# EAGLE design dev_kit_f103v5 (EAGLE 9.6.2)
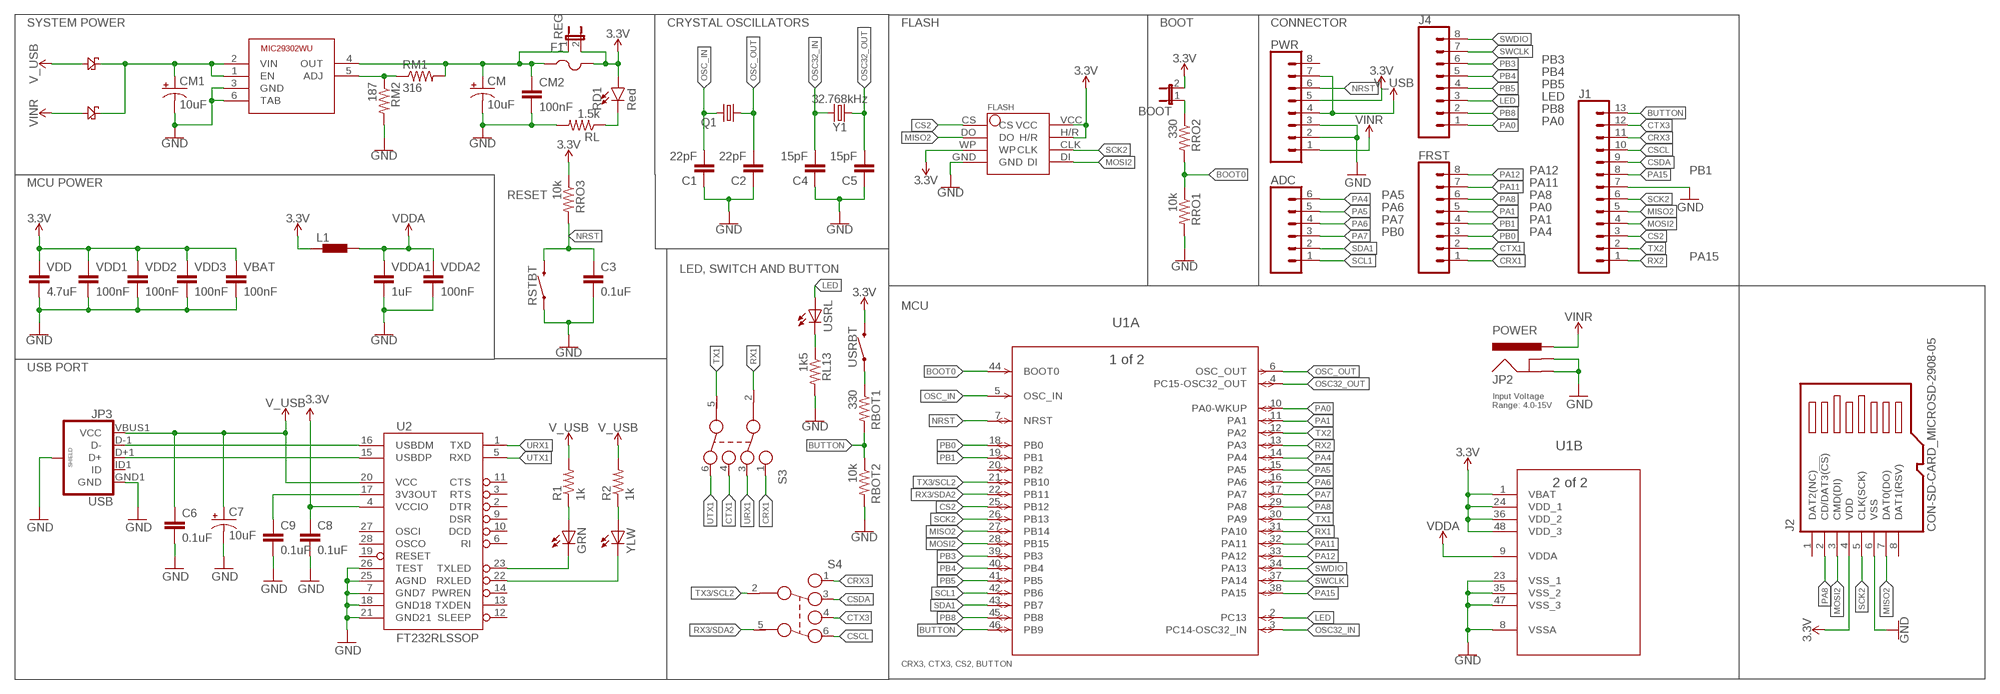
[diagram p0: schematic, sheet 1]

## Parts
ADC  CONN_06SILK_FEMALE_PTH  [1X06]
BOOT  JP1E  [JP1]
C1  22pF  22PF-0603-50V-5%  [0603]
C2  22pF  22PF-0603-50V-5%  [0603]
C3  0.1uF  22PF-0603-50V-5%  [0603]
C4  15pF  22PF-0603-50V-5%  [0603]
C5  15pF  22PF-0603-50V-5%  [0603]
C6  0.1uF  CAP0402-CAP  [0402-CAP]
C7  10uF  CAP_POL1206  [EIA3216]
C8  0.1uF  CAP0402-CAP  [0402-CAP]
C9  0.1uF  CAP0402-CAP  [0402-CAP]
CM  10uF  10UF-POLAR-EIA3528-20V-10%(TANT)  [EIA3528]
CM1  10uF  10UF-POLAR-EIA3528-20V-10%(TANT)  [EIA3528]
CM2  100nF  0.1UF-0603-25V-(+80/-20%)  [0603]
D1  3ASCHOOTKY  [3ASCHOOTKY]
D2  3ASCHOOTKY  [3ASCHOOTKY]
F1  PTCFUSE-1812  [1812]
FLASH  W25Q64  [W25Q64]
FRST  CONN_08"  [1X08]
GRN  LEDCHIP-LED0603  [CHIP-LED0603]
IC1  MIC29302WU  [TO263-5]
J1  CONN_13  [1X13]
J2  CON-SD-CARD_MICROSD-2908-05  [CON-SD-CARD_2908-05]
J4  CONN_08"  [1X08]
JP2  POWER  POWER_JACKPTH_LOCK  [POWER_JACK_PTH_LOCK]
JP3  USB  USB_MICROB_PLUGCONN-11752  [USB-B-MICRO-SMD_V03]
L1  BLM15HB221SN1  [0402]
PWR  CONN_08"  [1X08]
Q1  CRYSTALHC49S  [HC49/S]
R1  1k  RESISTOR0402-RES  [0402-RES]
R2  1k  RESISTOR0402-RES  [0402-RES]
RBOT1  330  2.0KOHM1/10W5%(0603)  [0603-RES]
RBOT2  10k  2.0KOHM1/10W5%(0603)  [0603-RES]
RD1  Red  LED-RED0603-SMART  [LED-0603]
REG  JP1E  [JP1]
RL  1.5k  2.0KOHM1/10W5%(0603)  [0603-RES]
RL13  1k5  2.0KOHM1/10W5%(0603)  [0603-RES]
RM1  316  2.0KOHM1/10W5%(0603)  [0603-RES]
RM2  187  2.0KOHM1/10W5%(0603)  [0603-RES]
RRO1  10k  2.0KOHM1/10W5%(0603)  [0603-RES]
RRO2  330  2.0KOHM1/10W5%(0603)  [0603-RES]
RRO3  10k  2.0KOHM1/10W5%(0603)  [0603-RES]
RSTBT  MOMENTARY-SWITCH-SPST-SMD-6.0X3.5MM  [TACTILE_SWITCH_SMD_6.0X3.5MM]
S3  452403012014  [452403012014]
S4  452403012014  [452403012014]
U1  STM32F103C8T6  [LQFP48-7X7MM]
U2  FT232RLSSOP  [SSOP28DB]
USRBT  MOMENTARY-SWITCH-SPST-SMD-6.0X3.5MM  [TACTILE_SWITCH_SMD_6.0X3.5MM]
USRL  LEDCHIP-LED0603  [CHIP-LED0603]
VBAT  100nF  0.1UF-0603-25V-(+80/-20%)  [0603]
VDD  4.7uF  0.1UF-0603-25V-(+80/-20%)  [0603]
VDD1  100nF  0.1UF-0603-25V-(+80/-20%)  [0603]
VDD2  100nF  0.1UF-0603-25V-(+80/-20%)  [0603]
VDD3  100nF  0.1UF-0603-25V-(+80/-20%)  [0603]
VDDA1  1uF  0.1UF-0603-25V-(+80/-20%)  [0603]
VDDA2  100nF  0.1UF-0603-25V-(+80/-20%)  [0603]
Y1  32.768kHz  CRYSTAL-32.768KHZPTH-2X6-KIT  [CRYSTAL-PTH-2X6-CYL-KIT]
YLW  LEDCHIP-LED0603  [CHIP-LED0603]

## Nets
3.3V: BOOT.2 F1.2 FLASH.H/R FLASH.VCC FLASH.WP J2.4(VDD) L1.1 PWR.5 RD1.A REG.2 RRO3.1 U1.1(B:VBAT) U1.24(B:VDD_1) U1.36(B:VDD_2) U1.48(B:VDD_3) USRBT.2 VBAT.1 VDD1.1 VDD2.1 VDD3.1 VDD.1
BOOT0: RRO1.1 RRO2.2 U1.44(A:BOOT0)
BUTTON: J1.13 RBOT1.2 RBOT2.1 U1.46(A:PB9)
CRX1: FRST.1 S3.1
CRX3: J1.11 S4.1
CS2: FLASH.CS J1.3 U1.25(A:PB12)
CSCL: J1.10 S4.6
CSDA: J1.9 S4.3
CTX1: FRST.2 S3.4
CTX3: J1.12 S4.4
GND: C1.1 C2.1 C3.2 C4.1 C5.1 C6.2 C7.C(-) C8.2 C9.2 CM1.C(-) CM2.2 CM.C(-) FLASH.GND IC1.3(GND) IC1.6(TAB) J1.7 J2.6(VSS) JP2.GND JP2.GNDBREAK JP3.GND1(GND) JP3.SHIELD1(SHIELD) JP3.SHIELD2(SHIELD) JP3.SHIELD3(SHIELD) PWR.2 PWR.3 RBOT2.2 RL13.2 RL.2 RM2.2 RRO1.2 RSTBT.1 U1.8(B:VSSA) U1.23(B:VSS_1) U1.35(B:VSS_2) U1.47(B:VSS_3) U2.7(GND7) U2.18(GND18) U2.21(GND21) U2.25(AGND) U2.26(TEST) VBAT.2 VDD1.2 VDD2.2 VDD3.2 VDD.2 VDDA1.2 VDDA2.2
LED: J4.3 U1.2(A:PC13) USRL.A
MISO2: FLASH.DO J1.5 J2.7(DAT0(DO)) U1.27(A:PB14)
MOSI2: FLASH.DI J1.4 J2.3(CMD(DI)) U1.28(A:PB15)
N$1: CM1.A(+) D1.OUT D2.OUT IC1.1(EN) IC1.2(VIN)
N$2: CM2.1 CM.A(+) F1.1 IC1.4(OUT) REG.1 RM1.2
N$3: BOOT.1 RRO2.1
N$4: RL13.1 USRL.C
N$5: RBOT1.1 USRBT.1
N$6: GRN.A R1.1
N$7: R2.1 YLW.A
N$8: C9.1 U2.17(3V3OUT)
N$20: IC1.5(ADJ) RM1.1 RM2.1
N$35: RD1.C RL.1
NRST: C3.1 PWR.6 RRO3.2 RSTBT.2 U1.7(A:NRST)
OSC32_IN: C4.2 U1.3(A:PC14-OSC32_IN) Y1.2
OSC32_OUT: C5.2 U1.4(A:PC15-OSC32_OUT) Y1.1
OSC_IN: C1.2 Q1.2 U1.5(A:OSC_IN)
OSC_OUT: C2.2 Q1.1 U1.6(A:OSC_OUT)
PA0: J4.1 U1.10(A:PA0-WKUP)
PA1: FRST.5 U1.11(A:PA1)
PA4: ADC.6 U1.14(A:PA4)
PA5: ADC.5 U1.15(A:PA5)
PA6: ADC.4 U1.16(A:PA6)
PA7: ADC.3 U1.17(A:PA7)
PA8: FRST.6 J2.2(CD/DAT3(!CS!)) U1.29(A:PA8)
PA11: FRST.7 U1.32(A:PA11)
PA12: FRST.8 U1.33(A:PA12)
PA15: J1.8 U1.38(A:PA15)
PB0: FRST.3 U1.18(A:PB0)
PB1: FRST.4 U1.19(A:PB1)
PB3: J4.6 U1.39(A:PB3)
PB4: J4.5 U1.40(A:PB4)
PB5: J4.4 U1.41(A:PB5)
PB8: J4.2 U1.45(A:PB8)
RX1: S3.2 U1.31(A:PA10)
RX2: J1.1 U1.13(A:PA3)
RX3/SDA2: S4.5 U1.22(A:PB11)
RXLED: U2.22(RXLED) YLW.C
SCK2: FLASH.CLK J1.6 J2.5(CLK(SCK)) U1.26(A:PB13)
SCL1: ADC.1 U1.42(A:PB6)
SDA1: ADC.2 U1.43(A:PB7)
SWCLK: J4.7 U1.37(A:PA14)
SWDIO: J4.8 U1.34(A:PA13)
TX1: S3.5 U1.30(A:PA9)
TX2: J1.2 U1.12(A:PA2)
TX3/SCL2: S4.2 U1.21(A:PB10)
TXLED: GRN.C U2.23(TXLED)
URX1: S3.3 U2.1(TXD)
USB_D+: JP3.D+1(D+) U2.15(USBDP)
USB_D-: JP3.D-1(D-) U2.16(USBDM)
UTX1: S3.6 U2.5(RXD)
V_USB: C6.1 C7.A(+) D1.IN JP3.VBUS1(VCC) PWR.4 PWR.7 R1.2 R2.2 U2.20(VCC)
VCC: C8.1 U2.4(VCCIO) ; supply symbol labelled 3.3V
VDDA: L1.2 U1.9(B:VDDA) VDDA1.1 VDDA2.1
VIN: D2.IN JP2.PWR PWR.1 ; supply symbol labelled VINR
Unconnected: J2.1(DAT2(NC)) J2.8(DAT1(RSV)) J2.GND@1(GND) J2.GND@2(GND) J2.GND@3(GND) J2.GND@4(GND) JP3.ID1(ID) PWR.8 U1.20(A:PB2) U2.2(DTR) U2.3(RTS) U2.6(RI) U2.9(DSR) U2.10(DCD) U2.11(CTS) U2.12(SLEEP) U2.13(TXDEN) U2.14(PWREN) U2.19(RESET) U2.27(OSCI) U2.28(OSCO)

## Notes on the sheet
- SYSTEM POWER | CRYSTAL OSCILLATORS | FLASH | BOOT | CONNECTOR
- PB3
- PB4
- PB5
- LED
- PB8
- PA0
- PA12 | PB1
- MCU POWER | PA11
- RESET | PA5 | PA8
- PA6 | PA0
- PA7 | PA1
- PB0 | PA4
- PA15
- LED, SWITCH AND BUTTON
- MCU
- USB PORT
- Input Voltage
  Range: 4.0-15V
- CRX3, CTX3, CS2, BUTTON

## Library data of the parts
ADC = SparkFun-Connectors:CONN_06: Multi connection point. Often used as Generic Header-pin footprint for 0.1 inch spaced/style header connections On any of the 0.1 inch spaced packages, you can populate with these: Break Away Headers - Straight <https://www.sparkfun.com/products/116> (PRT-00116) Break Away Male Headers - Right Angle <https://www.sparkfun.com/products/553> (PRT-00553) Female Headers <https://www.sparkfun.com/products/115> (PRT-00115) Break Away Headers - Machine Pin <https://www.sparkfun.com/products/117> (PRT-00117) Break Away Female Headers - Swiss Machine Pin <https://www.sparkfun.com/products/743> (PRT-00743) Arduino Stackable Header - 6 Pin <https://www.sparkfun.com/products/9280> (PRT-09280) For SCREWTERMINALS and SPRING TERMINALS visit here: Screw Terimnals on SparkFun.com <https://www.sparkfun.com/search/results?term=Screw+Terminals> (5mm/3.5mm/2.54mm spacing) This device is also useful as a general connection point to wire up your design to another part of your project. Our various solder wires solder well into these plated through hole pads. Hook-Up Wire - Assortment (Stranded, 22 AWG) <https://www.sparkfun.com/products/11375> (PRT-11375) Hook-Up Wire - Assortment (Solid Core, 22 AWG) <https://www.sparkfun.com/products/11367> (PRT-11367) View the entire wire category on our website here <https://www.sparkfun.com/categories/141>; PROD_ID: CONN-08437
BOOT REG = jumper:JP1E: JUMPER
C1 C2 = SparkFun-Capacitors:22PF: 22pF ceramic capacitors A capacitor is a passive two-terminal electrical component used to store electrical energy temporarily in an electric field.; PROD_ID: CAP-07876
C3-C5 = SparkFun-Capacitors:22PF: 22pF ceramic capacitors A capacitor is a passive two-terminal electrical component used to store electrical energy temporarily in an electric field.; PROD_ID: CAP-07876; VALUE: 22pF
C6 C8 C9 = SparkFun:CAP: Capacitor Standard 0603 ceramic capacitor, and 0.1" leaded capacitor.
C7 = SparkFun:CAP_POL: Capacitor Polarized These are standard SMD and PTH capacitors. Normally 10uF, 47uF, and 100uF in electrolytic and tantalum varieties. Always verify the external diameter of the through hole cap, it varies with capacity, voltage, and manufacturer. The EIA devices should be standard.
CM CM1 = SparkFun-Capacitors:10UF-POLAR: 10.0µF polarized capacitors A capacitor is a passive two-terminal electrical component used to store electrical energy temporarily in an electric field.; PROD_ID: CAP-08063
CM2 VBAT VDD VDD1-VDD3 VDDA1 VDDA2 = SparkFun-Capacitors:0.1UF: 0.1µF ceramic capacitors A capacitor is a passive two-terminal electrical component used to store electrical energy temporarily in an electric field.; PROD_ID: CAP-00810; VALUE: 0.1uF
D1 D2 = 1N4007:3ASCHOOTKY
F1 = adafruit:PTCFUSE: PTC fuses, resettable thermistors
FLASH = W25Q64:W25Q64
FRST J4 PWR = SparkFun-Connectors:CONN_08: Multi connection point. Often used as Generic Header-pin footprint for 0.1 inch spaced/style header connections On any of the 0.1 inch spaced packages, you can populate with these: Break Away Headers - Straight <https://www.sparkfun.com/products/116> (PRT-00116) Break Away Male Headers - Right Angle <https://www.sparkfun.com/products/553> (PRT-00553) Female Headers <https://www.sparkfun.com/products/115> (PRT-00115) Break Away Headers - Machine Pin <https://www.sparkfun.com/products/117> (PRT-00117) Break Away Female Headers - Swiss Machine Pin <https://www.sparkfun.com/products/743> (PRT-00743) Arduino Stackable Header - 8 Pin <https://www.sparkfun.com/products/9279> (PRT-09279) For SCREWTERMINALS and SPRING TERMINALS visit here: Screw Terimnals on SparkFun.com <https://www.sparkfun.com/search/results?term=Screw+Terminals> (5mm/3.5mm/2.54mm spacing) This device is also useful as a general connection point to wire up your design to another part of your project. Our various solder wires solder well into these plated through hole pads. Hook-Up Wire - Assortment (Stranded, 22 AWG) <https://www.sparkfun.com/products/11375> (PRT-11375) Hook-Up Wire - Assortment (Solid Core, 22 AWG) <https://www.sparkfun.com/products/11367> (PRT-11367) View the entire wire category on our website here <https://www.sparkfun.com/categories/141> Special notes: Molex polarized connector foot print use with SKU : PRT-08231 with associated crimp pins and housings. 1MM SMD Version SKU: PRT-10208 NOTES ON THE VARIANTS LOCK and LOCK_LONGPADS... This footprint was designed to help hold the alignment of a through-hole component (i.e. 6-pin header) while soldering it into place. You may notice that each hole has been shifted either up or down by 0.005 of an inch from it's more standard position (which is a perfectly straight line). This slight alteration caused the pins (the squares in the middle) to touch the edges of the holes. Because they are alternating, it causes a "brace" to hold the component in place. 0.005 has proven to be the perfect amount of "off-center" position when using our standard breakaway headers. Although looks a little odd when you look at the bare footprint, once you have a header in there, the alteration is very hard to notice. Also,if you push a header all the way into place, it is covered up entirely on the bottom side.; PROD_ID: CONN-08438
GRN USRL YLW = adafruit:LED: LED OSRAM: - CHIPLED LG R971, LG N971, LY N971, LG Q971, LY Q971, LO R971, LY R971 LH N974, LH R974 LS Q976, LO Q976, LY Q976 LO Q996 - Hyper CHIPLED LW Q18S LB Q993, LB Q99A, LB R99A - SideLED LS A670, LO A670, LY A670, LG A670, LP A670 LB A673, LV A673, LT A673, LW A673 LH A674 LY A675 LS A676, LA A676, LO A676, LY A676, LW A676 LS A679, LY A679, LG A679 - Hyper Micro SIDELED® LS Y876, LA Y876, LO Y876, LY Y876 LT Y87S - SmartLED LW L88C, LW L88S LB L89C, LB L89S, LG L890 LS L89K, LO L89K, LY L89K LS L896, LA L896, LO L896, LY L896 - TOPLED LS T670, LO T670, LY T670, LG T670, LP T670 LSG T670, LSP T670, LSY T670, LOP T670, LYG T670 LG T671, LOG T671, LSG T671 LB T673, LV T673, LT T673, LW T673 LH T674 LS T676, LA T676, LO T676, LY T676, LB T676, LH T676, LSB T676, LW T676 LB T67C, LV T67C, LT T67C, LS T67K, LO T67K, LY T67K, LW E67C LS E67B, LA E67B, LO E67B, LY E67B, LB E67C, LV E67C, LT E67C LW T67C LS T679, LY T679, LG T679 LS T770, LO T770, LY T770, LG T770, LP T770 LB T773, LV T773, LT T773, LW T773 LH T774 LS E675, LA E675, LY E675, LS T675 LS T776, LA T776, LO T776, LY T776, LB T776 LHGB T686 LT T68C, LB T68C - Hyper Mini TOPLED® LB M676 - Mini TOPLED Santana® LG M470 LS M47K, LO M47K, LY M47K Source: http://www.osram.convergy.de/
IC1 = MIC29302WU:MIC29302WU: Check prices <https://pricing.snapeda.com/parts/MIC29302WU/Microchip%20Technology/view-part?ref=eda>; AVAILABILITY: Good; DESCRIPTION: Linear Voltage Regulator IC Positive Adjustable 1 Output 3A TO-263-5; MF: Microchip Technology; MP: MIC29302WU; PACKAGE: TO-263-6 Microchip Technology; PRICE: None; PURCHASE-URL: https://pricing.snapeda.com/search/part/MIC29302WU/?ref=eda
J1 = SparkFun-Connectors:CONN_13: Multi connection point. Often used as Generic Header-pin footprint for 0.1 inch spaced/style header connections On any of the 0.1 inch spaced packages, you can populate with these: Break Away Headers - Straight <https://www.sparkfun.com/products/116> (PRT-00116) Break Away Male Headers - Right Angle <https://www.sparkfun.com/products/553> (PRT-00553) Female Headers <https://www.sparkfun.com/products/115> (PRT-00115) Break Away Headers - Machine Pin <https://www.sparkfun.com/products/117> (PRT-00117) Break Away Female Headers - Swiss Machine Pin <https://www.sparkfun.com/products/743> (PRT-00743) For SCREWTERMINALS and SPRING TERMINALS visit here: Screw Terimnals on SparkFun.com <https://www.sparkfun.com/search/results?term=Screw+Terminals> (5mm/3.5mm/2.54mm spacing) This device is also useful as a general connection point to wire up your design to another part of your project. Our various solder wires solder well into these plated through hole pads. Hook-Up Wire - Assortment (Stranded, 22 AWG) <https://www.sparkfun.com/products/11375> (PRT-11375) Hook-Up Wire - Assortment (Solid Core, 22 AWG) <https://www.sparkfun.com/products/11367> (PRT-11367) View the entire wire category on our website here <https://www.sparkfun.com/categories/141> Special notes: Molex polarized connector foot print use with SKU : PRT-08231 with associated crimp pins and housings. 1MM SMD Version SKU: PRT-10208 NOTES ON THE VARIANTS LOCK and LOCK_LONGPADS... This footprint was designed to help hold the alignment of a through-hole component (i.e. 6-pin header) while soldering it into place. You may notice that each hole has been shifted either up or down by 0.005 of an inch from it's more standard position (which is a perfectly straight line). This slight alteration caused the pins (the squares in the middle) to touch the edges of the holes. Because they are alternating, it causes a "brace" to hold the component in place. 0.005 has proven to be the perfect amount of "off-center" position when using our standard breakaway headers. Although looks a little odd when you look at the bare footprint, once you have a header in there, the alteration is very hard to notice. Also,if you push a header all the way into place, it is covered up entirely on the bottom side.
J2 = 52101-101-REV-A_v16:CON-SD-CARD_MICROSD-: microSD Connector
JP2 = SparkFun-Connectors:POWER_JACK: Power Jack This is the standard 5.5mm barrel jack for power. The PTH is the most common, proven, reliable, footprint. The Slot footprint only works if the mill layer is transmitted to the PCB fab house so be warned. Mating wall wart : TOL-00298 (and others); PROD_ID: CONN-08197; SF_ID: PRT-00119
JP3 = SparkFun-Connectors:USB_MICROB_PLUG: USB Micro-B connectors Some male, some female. Watch your step!; PROD_ID: CONN-11752
L1 = inductors:BLM15H: EMIFIL (R) Chip Ferrite Bead for GHz Noise Source: http://www.murata.com/ Ferrite Bead BLM15H.pdf
Q1 = crystal:CRYSTAL: CRYSTAL; OC_FARNELL: 1667008; OC_NEWARK: unknown
R1 R2 = SparkFun:RESISTOR: Resistor Basic schematic elements and footprints for 0603, 1206, and PTH resistors.
RBOT1 RBOT2 RL RL13 RM1 RM2 RRO1-RRO3 = SparkFun-Resistors:2.0KOHM1/10W5%(0603): RES-08296; PROD_ID: RES-08296; VALUE: 2.0k
RD1 = SparkFun-LED:LED-RED: Red SMD LED Used in manufacturing of most products at SparkFun Packages: 0603 - SMD 0603 package [Product Link] <http://docs.avagotech.com/docs/AV02-0551EN> 0603 SMART - SMD 0603 SMART package ( more efficient and expensive)[Product Link] <http://www.osram-os.com/Graphics/XPic2/00077099_0.pdf> 1206 - SMD1206 package [Product Link] <https://www.sparkfun.com/datasheets/DevTools/LilyPad/Q150OVS4.pdff> SparkFun Products: Pro Mini 328 -5V <https://www.sparkfun.com/products/821> RedBoard <https://www.sparkfun.com/products/12757> IOIO-OTG <https://www.sparkfun.com/products/13613>; PROD_ID: DIO-11154
RSTBT USRBT = SparkFun-Switches:MOMENTARY-SWITCH-SPST: Momentary Switch (Pushbutton) - SPST Normally-open (NO) SPST momentary switches (buttons, pushbuttons). Variants PTH-12MM - 12mm square, through-hole Momentary Pushbutton Switch - 12mm Square <https://www.sparkfun.com/products/9190> (COM-09190) PTH-6.0MM, PTH-6.0MM-KIT - 6.0mm square, through-hole Mini Pushbutton Switch <https://www.sparkfun.com/products/97> (COM-00097) KIT package intended for soldering kit's - only one side of pads' copper is exposed. PTH-RIGHT-ANGLE-KIT - Right-angle, through-hole Right Angle Tactile Button <https://www.sparkfun.com/products/10791> - Used on SparkFun BigTime Watch Kit <https://www.sparkfun.com/products/11734> SMD-12MM - 12mm square, surface-mount Tactile Button - SMD (12mm) <https://www.sparkfun.com/products/12993> (COM-12993) Used on SparkFun PicoBoard <https://www.sparkfun.com/products/11888> SMD-4.5MM - 4.5mm Square Trackball Switch Used on SparkFun Blackberry Trackballer Breakout <https://www.sparkfun.com/products/13169> SMD-4.6MMX2.8MM - 4.60mm x 2.80mm, surface mount Used on SparkFun SAMD21 Mini Breakout <https://www.sparkfun.com/products/13664> SMD-5.2MM, SMD-5.2-REDUNDANT - 5.2mm square, surface-mount Mini Pushbutton Switch - SMD <https://www.sparkfun.com/products/8720> (COM-08720) Used on Arduino Pro Mini <https://www.sparkfun.com/products/11114> REDUNDANT package connects both switch circuits together SMD-6.0X3.5MM - 6.0 x 3.5mm, surface mount Momentary Reset Switch SMD <https://www.sparkfun.com/products/8229> (COM-08229) SMD-6.2MM-TALL - 6.2mm square, surface mount Tactile Button - SMD (6mm) <https://www.sparkfun.com/products/12992> Used on SparkFun Digital Sandbox <https://www.sparkfun.com/products/12651> SMD-RIGHT-ANGLE - Right-angle, surface mount Used on SparkFun Block for Intel® Edison - Arduino <https://www.sparkfun.com/products/13036>; PROD_ID: SWCH-00815; SF_SKU: COM-08229
S3 S4 = step_switch:452403012014: WS-SLSV Slide Switch, SMD version, same side connection Specification Rating : 300mA, 6VDC Contact Resistance Initial: 50mΩ max. After life test: 200mΩ max. Insulation Resistance: min.100MΩ at 500VDC Dielectric Strength : 500VAC for 1 minute Total-Travel : 2.0±0.2mm Operation Force :200 ±150g Life cycle : :20,000 steps Switch function :ON-ON Material Cover : : Stainless steel Base :PA9T UL 94 V-0, color Black. Actuator :LCP UL 94 V-0, color Black Contact : :Copper Alloy with Silver Terminal : Copper Alloy with Silver <http://katalog.we-online.de/media/images/v2/Family_WS-SLSV_452403012014.jpg> Details see: http://katalog.we-online.de/en/em/SLSV_7_65X_5_5_SMD_VERTICAL?sid=d553d9ab8e 2015 (C) Würth Elektronik
U1 = STM32F103C8T6:STM32F103C8T6; BUILT_BY: EMA_UL_Team; COPYRIGHT: Copyright (C) 2018 Accelerated Designs. All rights reserved; MANUFACTURER_PART_NUMBER: STM32F103C8T6; SOURCELIBRARY: Updates_to_database_2020-10-19; VENDOR: STMicroelectronics
U2 = SparkFun:FT232RL: USB UART FT232RL 4th Generation USB UART (USB <-> Serial) Controller. Spark Fun Electronics SKU : COM-00650
Y1 = SparkFun-Clocks:CRYSTAL-32.768KHZ: 32.768kHz Crystal Frequency: 32.768kHz Frequency Stability: ±20ppm Load Capacitance: 12.5pF (PTH-2X6 & SMD-3.2X1.5), 6pF (SMD-2X6) SparkFun Products: SparkFun BigTime Watch Kit <https://www.sparkfun.com/products/11734> SparkFun nRF52832 Breakout <https://www.sparkfun.com/products/13990> SparkFun Real Time Clock Module <https://www.sparkfun.com/products/12708>; PROD_ID: XTAL-10112

## Net classes
1 power: width 0.254 mm

## Board
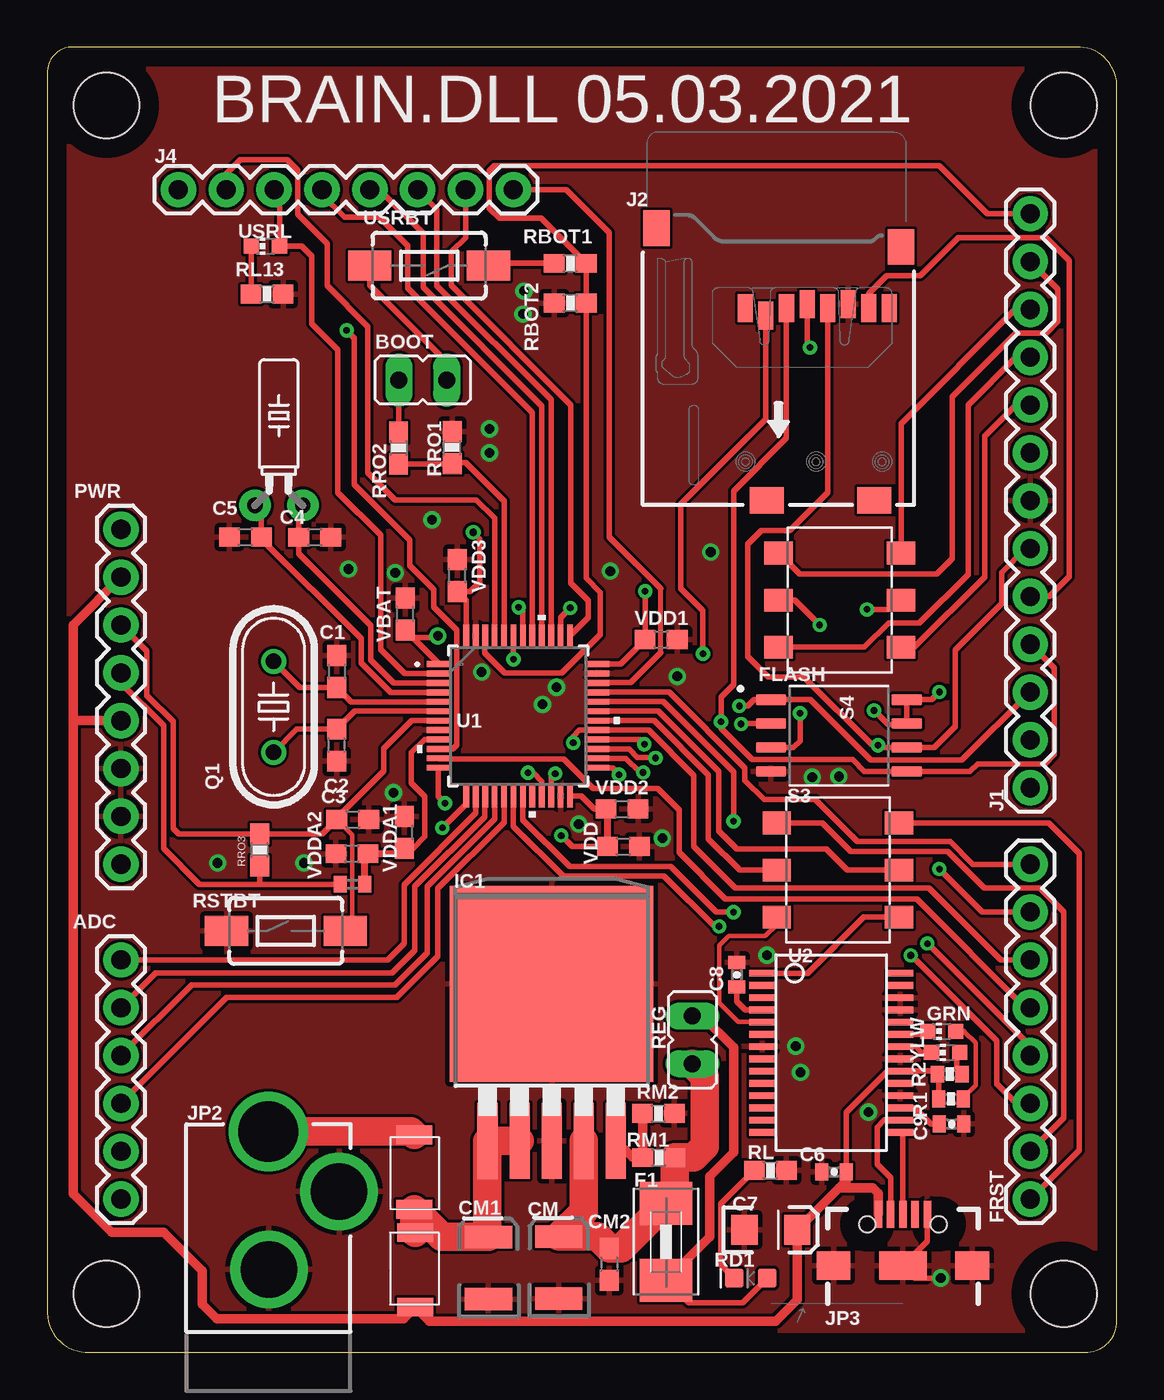
[diagram p1: board, top side]
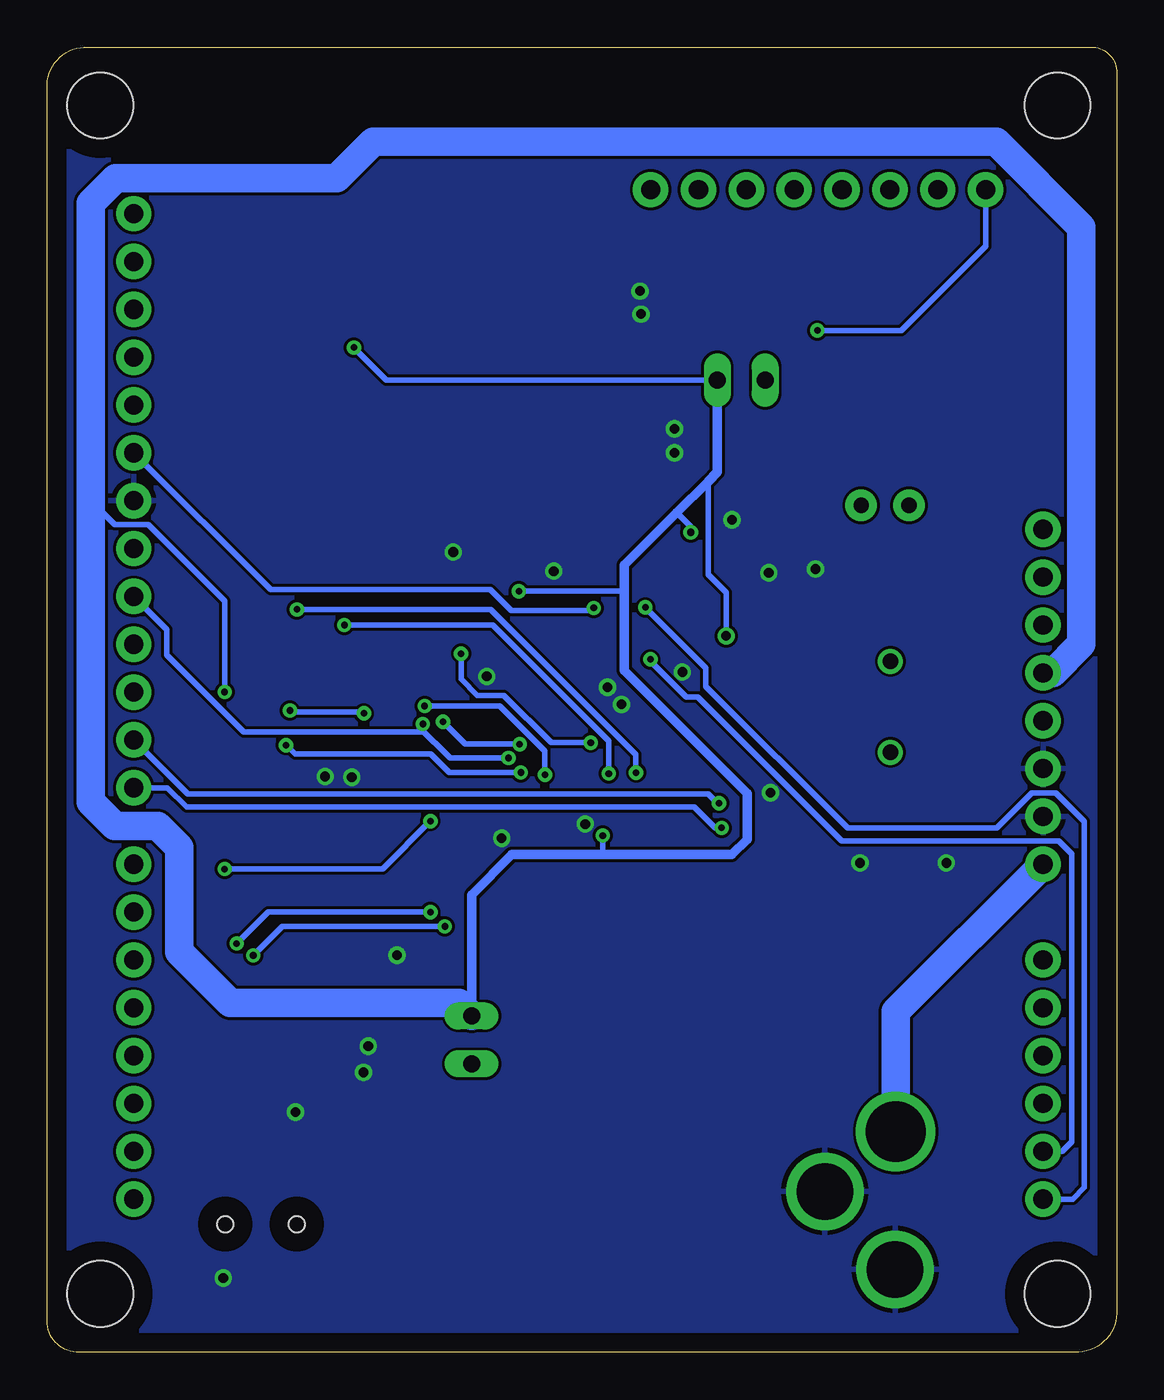
[diagram p2: board, bottom side, seen from below]

Size 56.78 x 69.3 mm. Coordinates in mm from the lower left corner, seen from the top.
Outline: 54.62,69.3 1.25,69.3 arc90 0.01,67.8 0.01,2.29 arc90 2.03,0.01 54.92,0.01 arc90 56.78,1.52 56.78,67.33 arc90 54.62,69.3
Copper layers (1*16): Top 0.035mm / dielectric 1.5mm / Bottom 0.035mm
Design rules "default": minimum track width 6mil, minimum drill 0.35mm, track to track 6mil, track to pad 6mil, pad to pad 6mil, via to via 6mil, smd to smd 6mil, copper to edge 40mil, drill to drill 6mil, minimum pad ring 10mil, minimum via ring 8mil, stop-mask expansion 4mil, vias tented up to drill 0mil, thermal gap 10mil
Holes 3.5 mm at 53.96,3.11 3.16,3.11 3.16,66.2 53.96,66.2

### Footprints (pad centres in the part's own frame; a part is rotated, then mirrored left to right if it is on the bottom)
1X06 = drill 1.016 pad 1.88: 1 0,0; 2 2.54,0; 3 5.08,0; 4 7.62,0; 5 10.16,0; 6 12.7,0
JP1 = drill 0.914 long: 1 0,-1.27; 2 0,1.27
0603 = smd 1.1 x 1: 1 -0.85,0; 2 0.85,0
0402-CAP = smd 0.7 x 0.9: 1 -0.65,0; 2 0.65,0
EIA3216 = smd 1.4 x 1.6: A 1.4,0; C -1.4,0
EIA3528 = smd 1.2 x 2.5: A 1.65,0; C -1.65,0
3ASCHOOTKY = smd 1 x 1.9: IN 0.446,-1.325; OUT 4.396,-1.325
1812 = smd 2.286 x 2.794: 1 -2.046,0; 2 2.046,0
W25Q64 = smd 1.61 x 0.58: CLK 3.605,-0.635; CS -3.605,1.905; DI 3.605,-1.905; DO -3.605,0.635; GND -3.605,-1.905; H/R 3.605,0.635; VCC 3.605,1.905; WP -3.605,-0.635
1X08 = drill 1.016 pad 1.88: 1 0,0; 2 2.54,0; 3 5.08,0; 4 7.62,0; 5 10.16,0; 6 12.7,0; 7 15.24,0; 8 17.78,0
CHIP-LED0603 = smd 0.8 x 0.8: A 0,-0.75; C 0,0.75
TO263-5 = smd 1.067 x 4.039: 1 -3.404,-5.791; 2 -1.702,-5.791; 3 0,-5.791; 4 1.702,-5.791; 5 3.404,-5.791 | smd 10.8 x 10.41: 6 0,2.54
1X13 = drill 1.016 pad 1.88: 1 0,0; 2 2.54,0; 3 5.08,0; 4 7.62,0; 5 10.16,0; 6 12.7,0; 7 15.24,0; 8 17.78,0; 9 20.32,0; 10 22.86,0; 11 25.4,0; 12 27.94,0; 13 30.48,0
CON-SD-CARD_2908-05 = smd 0.8 x 1.5: 1 1.761,3.847; 2 0.669,4.253; 3 -0.423,3.847; 4 -1.515,3.644; 5 -2.607,3.847; 6 -3.7,3.644; 7 -4.792,3.847; 8 -5.884,3.847 | smd 1.397 x 1.905: GND@1 -6.5,0.6; GND@2 6.473,-0.389 | smd 1.803 x 1.397: GND@3 0.631,14.059; GND@4 -5.084,14.059
POWER_JACK_PTH_LOCK = drill 2.997 pad 4.115: GND 0.025,6.557; GNDBREAK 3.762,10.7 | drill 3.2 pad 4.115: PWR 0,13.878
USB-B-MICRO-SMD_V03 = smd 1.45 x 0.4: D+1 2.725,0; D-1 2.725,0.65; GND1 2.725,-1.3; ID1 2.725,-0.65; VBUS1 2.725,1.3 | smd 1.5 x 1.8: SHIELD1 0,3.685; SHIELD2 0,-3.685 | smd 1.5 x 2.5: SHIELD3 0,0 | hole 0.85: 2.2,1.9; 2.2,-1.9
0402 = smd 0.7 x 0.9: 1 -0.65,0; 2 0.65,0
HC49/S = drill 0.813: 1 -2.413,0; 2 2.413,0
0402-RES = smd 0.7 x 0.9: 1 -0.65,0; 2 0.65,0
0603-RES = smd 1.1 x 1: 1 -0.85,0; 2 0.85,0
LED-0603 = smd 1 x 1: A -0.877,0; C 0.877,0
TACTILE_SWITCH_SMD_6.0X3.5MM = smd 2.3 x 1.6: 1 -3.15,0; 2 3.15,0
452403012014 = smd 1.2 x 1.5: 1 -2.5,3.25; 2 0,3.25; 3 2.5,3.25; 4 -2.5,-3.25; 5 0,-3.25; 6 2.5,-3.25
LQFP48-7X7MM = smd 1.194 x 0.305: 1 -4.25,2.75; 2 -4.25,2.25; 3 -4.25,1.75; 4 -4.25,1.25; 5 -4.25,0.75; 6 -4.25,0.25; 7 -4.25,-0.25; 8 -4.25,-0.75; 9 -4.25,-1.25; 10 -4.25,-1.75; 11 -4.25,-2.25; 12 -4.25,-2.75; 25 4.25,-2.75; 26 4.25,-2.25; 27 4.25,-1.75; 28 4.25,-1.25; 29 4.25,-0.75; 30 4.25,-0.25; 31 4.25,0.25; 32 4.25,0.75; 33 4.25,1.25; 34 4.25,1.75; 35 4.25,2.25; 36 4.25,2.75 | smd 0.305 x 1.194: 13 -2.75,-4.25; 14 -2.25,-4.25; 15 -1.75,-4.25; 16 -1.25,-4.25; 17 -0.75,-4.25; 18 -0.25,-4.25; 19 0.25,-4.25; 20 0.75,-4.25; 21 1.25,-4.25; 22 1.75,-4.25; 23 2.25,-4.25; 24 2.75,-4.25; 37 2.75,4.25; 38 2.25,4.25; 39 1.75,4.25; 40 1.25,4.25; 41 0.75,4.25; 42 0.25,4.25; 43 -0.25,4.25; 44 -0.75,4.25; 45 -1.25,4.25; 46 -1.75,4.25; 47 -2.25,4.25; 48 -2.75,4.25
SSOP28DB = smd 0.348 x 1.397: 1 -4.225,-3.656; 2 -3.575,-3.656; 3 -2.925,-3.656; 4 -2.275,-3.656; 5 -1.625,-3.656; 6 -0.975,-3.656; 7 -0.325,-3.656; 8 0.325,-3.656; 9 0.975,-3.656; 10 1.625,-3.656; 11 2.275,-3.656; 12 2.925,-3.656; 13 3.575,-3.656; 14 4.225,-3.656; 15 4.225,3.656; 16 3.575,3.656; 17 2.925,3.656; 18 2.275,3.656; 19 1.625,3.656; 20 0.975,3.656; 21 0.325,3.656; 22 -0.325,3.656; 23 -0.975,3.656; 24 -1.625,3.656; 25 -2.275,3.656; 26 -2.925,3.656; 27 -3.575,3.656; 28 -4.225,3.656
CRYSTAL-PTH-2X6-CYL-KIT = drill 0.813 pad 1.676: 1 -1.27,0; 2 1.27,0

### Placement (x,y rotation side)
ADC  3.92,8.14 90 top
BOOT  19.94,51.62 270 top
C1  15.37,36.15 270 top
C2  15.37,32.24 90 top
C3  16.22,28.3 0 top
C4  14.2,43.28 180 top
C5  10.52,43.29 0 top
C6  41.76,9.59 180 top
C7  38.41,6.51 0 top
C8  36.61,20.05 90 top
C9  48,12.13 0 top
CM  27.16,4.51 90 top
CM1  23.43,4.48 90 top
CM2  29.83,4.68 270 top
D1  18.22,1.97 90 top
D2  20.81,12 270 top
F1  32.85,5.88 270 top
FLASH  42.02,32.75 0 top
FRST  52.18,8.14 90 top
GRN  47.48,17.05 90 top
IC1  26.78,17.03 0 top
J1  52.18,29.98 90 top
J2  38.82,59.29 180 top
J4  6.97,61.73 0 top
JP2  11.74,-2.15 0 top
JP3  45.42,4.61 90 top
L1  16.21,24.86 0 top
PWR  3.92,25.92 90 top
Q1  12.02,34.27 90 top
R1  47.98,13.46 180 top
R2  47.9,14.77 180 top
RBOT1  27.77,57.82 0 top
RBOT2  27.77,55.71 180 top
RD1  37.34,3.95 180 top
REG  34.25,16.6 0 top
RL  38.39,9.66 0 top
RL13  11.67,56.19 0 top
RM1  32.47,10.35 0 top
RM2  32.44,12.68 0 top
RRO1  21.49,48.04 90 top
RRO2  18.65,48.02 270 top
RRO3  11.28,26.68 90 top
RSTBT  12.67,22.38 0 top
S3  41.97,25.61 270 top
S4  42.07,39.94 270 top
U1  25,33.79 0 top
U2  41.61,15.91 270 top
USRBT  20.27,57.7 180 top
USRL  11.58,58.73 90 top
VBAT  19.01,39.2 90 top
VDD  30.59,26.86 0 top
VDD1  32.59,37.84 0 top
VDD2  30.51,28.85 0 top
VDD3  21.77,41.24 90 top
VDDA1  18.96,27.6 90 top
VDDA2  16.18,26.48 180 top
Y1  12.3,44.97 0 top
YLW  47.68,15.92 90 top

### Tracks (layer width: path | path; a pad name or v marks a point on that pad's centre or on a via)
3.3V  (via drill 0.35, 0.38, 0.51)
  Top 0.229: 45.57,33.33 FLASH.H/R
  Top 0.305: F1.2 34.04,2.64 36.91,2.64 RD1.A | U1.24 28.34,29.54 29.04,28.85 VDD2.1 | U1.36 30.44,36.54 VDD1.1 v31.74,40.41 | U1.1 20.75,36.61 VBAT.1 19.4,37.96 20.66,37.96 v20.74,38.04 | PWR.5 3.92,35.54 6.18,33.28 6.18,26.76 8.08,24.86 11.28,24.86 | BOOT.2 21.21,52.57 17.12,56.66 USRBT.2 | v40.49,53.35 40.33,53.51 J2.4 | FLASH.H/R FLASH.VCC 46.95,34.66 v47.35,35.06 | VDD.1 27.87,26.86 v27.29,27.44 | FLASH.WP 39.61,32.12 39.96,32.47 v39.96,33.93 | v43.89,34.08 44.64,33.33 45.57,33.33 | 11.28,24.86 L1.1 | U1.48 22.25,39.92 VDD3.1 22.46,40.39 22.97,40.9 22.97,43.19 v22.62,43.54 | RRO3.1 11.28,24.86
  Top 0.381: VDD2.1 29.74,28.77 VDD.1
  Top 0.508: F1.2 35.16,6.14 35.16,9.35 36.43,10.62 36.43,16.19 34.75,17.87 REG.2
  Bottom 0.305: BOOT.2 38.76,51.62 v40.49,53.35 | v22.62,43.54 22.62,43.85 23.35,44.59 | 27.29,26.43 v27.29,27.44 | v47.35,35.06 47.35,39.89 51.42,43.95 53.19,43.95 54.46,45.22 | v43.89,34.08 43.8,33.99 40.02,33.99 v39.96,33.93 | 21.7,46.24 21.7,41.3 20.74,40.34 v20.74,38.04 | 26.14,40.4 26.16,40.41 v31.74,40.41
  Bottom 0.508: REG.2 34.25,24.29 32.11,26.43 27.29,26.43 20.43,26.43 19.62,27.24 19.62,29.68 26.14,36.2 26.14,40.4 26.14,41.79 23.35,44.59 21.7,46.24 21.21,46.73 BOOT.2
  Bottom 1.524: REG.2 34.93,18.55 47.06,18.55 49.77,21.26 49.77,26.81 50.91,27.95 53.19,27.95 54.46,29.22 54.46,45.22 54.46,61.02 53.13,62.35 41.4,62.35 39.48,64.27 6.41,64.27 1.89,59.75 1.89,37.6 3.41,36.08 PWR.5
BOOT0
  Top 0.152: 21.56,47.25 RRO1.1
  Top 0.229: 21.47,47.17 RRO1.1
  Top 0.305: RRO2.2 21.47,47.17 | U1.44 24.25,45.21 22.21,47.25 21.56,47.25
BUTTON
  Top 0.152: 23.22,38.01 U1.46
  Top 0.305: 23.22,38.01 23.22,37.14 24.29,36.08 27.32,36.08 29.37,38.12 29.37,40.35 28.62,41.1 RBOT2.1 RBOT1.2 26.23,60.21 23.98,60.21 23.48,60.72 23.48,62.75 23.73,63 47.35,63 49.9,60.46 J1.13
CRX1
  Top 0.305: FRST.1 54.77,10.73 54.77,26.5 53.16,28.11 S3.1
CRX3
  Top 0.305: S4.1 45.32,49.32 51.38,55.38 J1.11
CS2  (via drill 0.35)
  Top 0.152: v30.36,30.66 v30.37,30.68
  Top 0.305: U1.25 30.01,31.04 v30.37,30.68 | v36.74,34.32 37.18,34.32 37.52,34.66 FLASH.CS 40.51,34.66 43.72,31.44 48.55,31.44 52.17,35.06 J1.3
  Bottom 0.305: v30.36,30.66 30.36,31.93 32.75,34.32 v36.74,34.32
CSCL
  Top 0.305: S4.6 43.38,37.44 44.67,38.72 46.3,38.72 48.88,41.3 48.88,50.3 51.41,52.84 J1.10
CSDA
  Top 0.305: J1.9 51.41,50.3 49.75,48.64 49.75,41.17 46.02,37.44 S4.3
CTX1
  Top 0.305: S3.4 41.14,28.11 42.65,26.6 47.8,26.6 49.73,24.66 52.69,24.66 53.96,23.39 53.96,12.46 FRST.2
CTX3
  Top 0.305: S4.4 39.94,41.32 47.21,41.32 48.04,42.15 48.04,50.73 51.42,54.11 53.04,54.11 53.65,54.71 53.65,56.45 J1.12
GND  (via drill 0.51)
  Top 0.305: v47.43,3.95 46.08,3.95 JP3.SHIELD3 46.72,5.91 JP3.GND1
  other vias: 28.22,28.05 40.61,30.54 38.21,21.09 39.73,16.27 25.25,55.13 23.48,49.03 23.06,36.12 43.59,12.76 20.43,44.21 27.03,35.32 13.63,25.99 33.44,35.89 18.38,29.72 9.05,25.99 39.99,14.87 42.02,30.58 25.3,56.35 23.48,47.76 16,41.59 26.3,34.4 32.65,27.3 18.47,41.4 29.89,41.48 35.22,42.49
  pour Top: -1.16,70.62 57.92,70.62 57.92,-2.32 -1.16,-2.32
  pour Bottom: -2.43,71.64 -2.43,-3.51 59.32,-3.51 59.32,71.64
LED
  Top 0.305: J4.3 12.05,61.08 12.33,60.79 USRL.A 13.52,58.73 14.05,58.2 14.05,54.62 15.43,53.24 15.43,45.66 17.71,43.38 17.71,37.33 18.99,36.04 U1.2
MISO2  (via drill 0.35)
  Top 0.305: U1.27 30.88,32.04 31.33,31.59 32.26,31.59 v32.29,31.56 | v36.84,33.36 36.86,33.39 FLASH.DO | J1.5 53.19,40.14 54.24,41.19 54.24,57.96 53.02,59.18 48.36,59.18 46.34,57.16 44.56,57.16 43.61,56.21 J2.7
  Bottom 0.152: v36.84,33.36 36.8,33.33
  Bottom 0.305: v32.29,31.56 35.39,31.56 37.01,33.19 v36.84,33.36 | 36.8,33.33 36.8,32.94 46.35,32.94 50.43,37.01 50.43,38.38 J1.5
MOSI2  (via drill 0.35)
  Top 0.305: U1.28 31.44,32.54 v31.7,32.29 | J1.4 53.45,36.33 53.45,31.74 52.96,31.25 49.38,31.25 48.98,30.85 FLASH.DI 43.38,30.85 42.75,31.48 37.43,31.48 35.77,33.14 v35.77,33.48 35.77,34.81 36.43,35.47 36.43,45.73 39.24,48.54 J2.3
  Bottom 0.305: v31.7,32.29 34.58,32.29 v35.77,33.48
N$1
  Top 1.524: D1.OUT 19.48,6.42 D2.OUT 20.96,6.13 CM1.A 23.35,6.21 23.35,11.21 IC1.1 IC1.2
N$2
  Top 1.524: IC1.4 28.48,7.48 CM.A 29.2,6.16 CM2.1 30.46,5.53 F1.1 33.32,8.39 RM1.2 34.32,10.35 34.91,10.93 34.91,14.67 REG.1
N$3
  Top 0.305: BOOT.1 18.67,48.88 RRO2.1
N$4
  Top 0.152: RL13.1 10.83,56.2
  Top 0.305: USRL.C 10.83,56.2
N$5
  Top 0.229: USRBT.1 23.54,57.82
  Top 0.305: 23.54,57.82 RBOT1.1
N$6
  Top 0.229: 48.66,17.05 49.27,16.43 49.27,14.18 48.63,13.54 R1.1
  Top 0.305: 48.66,17.05 GRN.A
N$7
  Top 0.229: YLW.A 48.28,15.77 | R2.1 48.28,15.05
  Top 0.305: 48.28,15.77 48.28,15.05
N$8
  Top 0.305: U2.17 46.04,12.98 46.9,12.13 C9.1
N$20
  Top 0.508: RM2.1 31.62,12.68 RM1.1 31.07,10.35 IC1.5
N$35
  Top 0.305: RL.1 35.76,7.88 35.76,4.66 RD1.C
NRST
  Top 0.229: C3.1 16.2,27.47 16.2,22.76 RSTBT.2
  Top 0.305: U1.7 19.34,33.54 17.87,32.07 17.87,30.88 15.37,28.37 C3.1 14.6,27.53 RRO3.2 6.98,27.53 6.69,27.82 6.69,33.49 5.29,34.88 5.29,37.25 PWR.6
OSC32_IN
  Top 0.305: Y1.2 13.35,44.75 C4.2 13.35,42.42 17.18,38.59 17.18,36.77 18.4,35.54 U1.3
OSC32_OUT
  Top 0.152: U1.4
  Top 0.305: Y1.1 11.03,44.79 11.38,44.45 C5.2 11.38,43.19 16.67,37.9 16.67,36.61 18.24,35.03 U1.4
OSC_IN
  Top 0.305: Q1.2 13.4,35.3 C1.2 16.14,34.54 U1.5
OSC_OUT
  Top 0.305: Q1.1 13.25,33.09 C2.2 16.32,34.04 U1.6
PA0  (via drill 0.35)
  Top 0.152: U1.10
  Top 0.305: U1.10 21.54,32.03 21.75,32.24 21.75,38.36 20.53,39.58 20.53,40.5 19.25,41.78 19.25,43.14 16.31,46.08 16.31,53.85 v15.9,54.26
  Bottom 0.305: v15.9,54.26 11.44,54.26 6.97,58.73 J4.1
PA1
  Top 0.305: U1.11 20.79,31.5 27.42,31.5 28.98,29.95 32.41,29.95 33.55,28.81 33.55,26.53 36,24.08 46.14,24.08 51.92,18.3 FRST.5
PA4
  Top 0.305: U1.14 22.75,28.63 18.95,24.83 18.95,21.72 18.07,20.84 ADC.6
PA5
  Top 0.152: U1.15 23.23,29.52
  Top 0.305: 23.23,29.52 23.23,28.44 19.52,24.73 19.52,21.35 18.31,20.14 5.76,20.14 ADC.5
PA6
  Top 0.305: ADC.4 7.66,19.5 18.47,19.5 20.17,21.2 20.17,24.73 23.75,28.31 U1.16
PA7
  Top 0.305: U1.17 24.25,28.14 20.73,24.62 20.73,21.02 18.56,18.85 9.55,18.85 ADC.3
PA8  (via drill 0.35)
  Top 0.305: J2.2 38.15,49.54 33.64,45.03 33.64,40.55 34.81,39.38 v34.81,37.09 | v27.92,32.37 27.92,32.71 28.25,33.04 U1.29 31.92,33.04 34.32,30.63 34.32,26.86 36.53,24.66 46.79,24.66 50.61,20.84 FRST.6
  Bottom 0.305: v27.92,32.37 30.02,32.37 32.54,34.89 33.94,34.89 34.81,35.75 v34.81,37.09
PA11  (via drill 0.35)
  Top 0.152: U1.32 29.26,34.55
  Top 0.305: 29.26,34.55 32.69,34.55 36.43,30.81 v36.43,28.2 | v47.35,25.66 49.64,23.38 FRST.7
  Bottom 0.305: v36.43,28.2 38.97,25.66 v47.35,25.66
PA12
  Top 0.152: U1.33 29.26,35.05
  Top 0.305: 29.26,35.05 33.01,35.05 37.04,31.02 37.04,30.37 38.06,29.35 40.77,29.35 43,27.12 47.92,27.12 49.13,25.92 FRST.8
PA15  (via drill 0.35)
  Top 0.305: v27.77,39.52 27.25,39.01 U1.38
  Bottom 0.152: 27.77,39.39 v27.77,39.52
  Bottom 0.305: 27.77,39.39 32.14,39.39 33.25,40.49 44.92,40.49 J1.8
PB0  (via drill 0.35)
  Top 0.305: U1.18 24.75,27.93 27.38,25.3 32.73,25.3 35.42,22.62 v35.67,22.62 | FRST.3 51.42,13.22 50.39,14.25 50.39,16.54 45.85,21.08 v45.84,21.08
  Bottom 0.305: v35.67,22.62 44.3,22.62 v45.84,21.08
PB1  (via drill 0.35)
  Top 0.305: FRST.4 52.18,16.28 46.78,21.68 46.74,21.68 v46.71,21.71 | U1.19 25.25,28.28 27.73,25.8 33.1,25.8 35.52,23.38 v36.43,23.38
  Bottom 0.305: v36.43,23.38 45.05,23.38 v46.71,21.71
PB3
  Top 0.305: U1.39 26.75,38.15 26.75,38.16 26.75,50.58 20.69,56.64 20.69,60.71 J4.6
PB4
  Top 0.305: U1.40 26.25,50.25 19.95,56.55 19.95,59.41 17.63,61.73 J4.5
PB5
  Top 0.305: U1.41 25.75,49.88 19.13,56.5 19.13,58.76 17.63,60.26 15.8,60.26 14.59,61.48 J4.4
PB8
  Top 0.305: U1.45 23.75,44.29 22.78,45.26 18.47,45.26 17.02,46.71 17.02,54.47 14.87,56.62 14.87,58.87 13.3,60.44 13.3,62.76 12.73,63.33 10.26,63.33 9.51,62.58 J4.2
RX1
  Top 0.152: U1.31 29.26,34.05
  Top 0.305: 29.26,34.05 32.44,34.05 35.65,30.85 35.65,27.69 36.6,26.74 41.34,26.74 42.47,25.61 S3.2
RX2  (via drill 0.35)
  Top 0.305: U1.13 22.25,29.13 v20.97,27.85
  Bottom 0.305: v20.97,27.85 21.32,27.85 22.42,28.96 49.37,28.96 50.4,29.98 J1.1
RX3/SDA2  (via drill 0.35)
  Top 0.152: v26.97,30.73 26.91,30.73
  Top 0.305: U1.22 26.75,30.57 26.91,30.73 | v41,38.62 39.68,39.94 S4.5
  Bottom 0.305: v26.97,30.73 26.97,32.46 33.13,38.62 v41,38.62
RXLED
  Top 0.305: U2.22 46.09,16.23 46.4,15.92 YLW.C
SCK2  (via drill 0.35)
  Top 0.305: U1.26 30.72,31.54 31.47,30.79 v31.64,30.79 | J1.6 51.92,42.68 50.65,41.41 50.65,39.76 48.19,37.29 48.19,33.23 47.07,32.12 FLASH.CLK 44.23,32.12 v44.1,32.24 43.78,32.24 40.16,35.87 38.27,35.87 37.19,36.95 37.19,42.92 37.91,43.64 39.42,43.64 41.43,45.64 J2.5
  Bottom 0.305: v44.1,32.24 43.62,31.76 36.42,31.76 35.44,30.78 v31.65,30.78 v31.64,30.79
SCL1  (via drill 0.35)
  Top 0.152: 25.25,39.33 v25.03,39.56
  Top 0.305: U1.42 25.25,39.33
  Bottom 0.305: v25.03,39.56 21.81,36.34 21.81,35.36 14.29,27.85 6.38,27.85 4.53,29.7 3.24,29.7 1.72,28.19 1.72,8.76 2.34,8.14 ADC.1
SDA1  (via drill 0.35)
  Top 0.152: v24.75,36.8 v24.75,36.79
  Top 0.305: U1.43 v24.75,36.8
  Bottom 0.152: v24.75,36.79 24.75,36.69
  Bottom 0.305: 24.75,36.69 22.85,34.79 22.24,34.79 14.61,27.17 3.09,27.17 2.39,26.47 2.39,11.19 2.9,10.68 ADC.2
SWCLK
  Top 0.305: J4.7 22.21,59.19 21.44,58.43 21.44,56.65 27.8,50.3 27.8,40.84 28.71,39.93 28.71,39 U1.37
SWDIO
  Top 0.152: U1.34 29.28,35.57
  Top 0.254: 32.57,37.16 32.57,40.55
  Top 0.305: 29.28,35.57 30.98,35.57 32.57,37.16 | 32.57,40.55 29.83,43.3 29.83,59.45 27.54,61.73 J4.8
TX1
  Top 0.305: U1.30 32.21,33.54 35.1,30.65 35.1,27.26 36.75,25.61 S3.5
TX2  (via drill 0.35)
  Top 0.305: U1.12 20.75,29.53 v21.12,29.16
  Bottom 0.305: v21.12,29.16 21.22,29.16 21.7,29.64 49.3,29.64 J1.2
TX3/SCL2  (via drill 0.35)
  Top 0.305: U1.21 26.25,30.32 25.79,30.78 v25.52,30.78 | S4.2 45.1,39.94 44.61,39.45 v43.52,39.45
  Bottom 0.305: v25.52,30.78 v25.53,30.79 25.53,31.74 33.23,39.45 v43.52,39.45
TXLED
  Top 0.305: U2.23 46.56,16.88 GRN.C
URX1
  Top 0.305: U2.1 40.37,20.13 43.34,23.11 S3.3
USB_D+
  Top 0.305: U2.15 45.42,11.53 JP3.D+1
USB_D-
  Top 0.305: U2.16 44.44,12.33 44.05,11.95 44.05,9.99 44.77,9.27 JP3.D-1
UTX1
  Top 0.229: S3.6 38.72,22.7 38.12,22.11 36.18,22.11 35.67,21.6 35.67,18.55 36.69,17.53 U2.5
V_USB
  Top 0.229: 47.09,14.93 R2.2
  Top 0.305: C6.1 42.41,12.73 44.62,14.94 U2.20 47.09,14.93 | R2.2 47.33,14.7 R1.2
  Top 0.508: C6.1 42.41,9.11 42.05,8.75 | JP3.VBUS1 44.12,8.45 43.82,8.75 42.05,8.75 | 1.38,33.54 1.38,38.62 PWR.7 | 1.38,33.54 1.38,8.42 3.42,6.37 6.19,6.37 8.24,4.33 8.24,2.55 9,1.79 18.92,1.79 D1.IN 20.29,1.66 38.67,1.66 39.81,2.81 C7.A 42.05,8.75 | PWR.4 1.38,33.54
VCC
  Top 0.305: U2.4 37.05,18.18 36.61,18.63 C8.1
VDDA
  Top 0.305: VDDA1.1 19.42,26.75 20.05,27.38 20.05,29.52 19.34,30.23 19.34,31.85 20.03,32.54 U1.9
  Top 0.381: L1.2 16.86,26.31 VDDA2.1 18.68,26.48 VDDA1.1
VIN
  Top 1.524: JP2.PWR 19.31,11.73 D2.IN
  Bottom 1.524: PWR.1 11.74,18.09 JP2.PWR

### Text on the board
tPlace: BRAIN.DLL | 05.03.2021